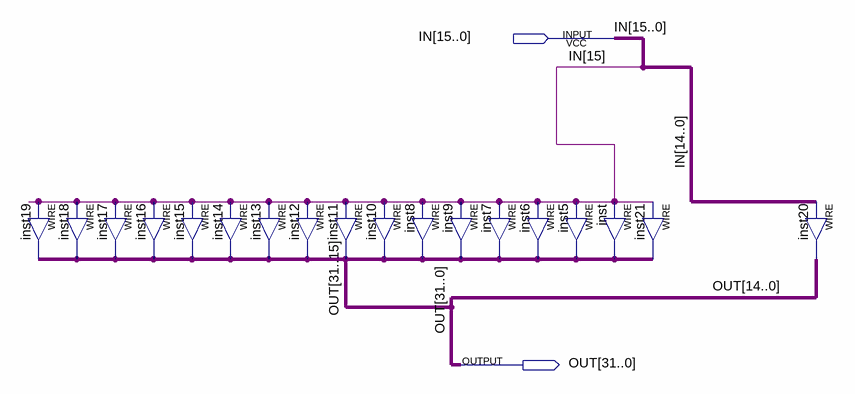
[diagram p0: schematic sheet]
// Quartus schematic sign_extend.bdf as structural Verilog: 18 symbols, 2 pins
module sign_extend (
  input  [15:0] IN,
  output [31:0] OUT
);

  assign OUT[31:15] = {17{IN[15]}};  // WIRE inst18
  assign OUT[31:15] = {17{IN[15]}};  // WIRE inst19
  assign OUT[31:15] = {17{IN[15]}};  // WIRE inst16
  assign OUT[31:15] = {17{IN[15]}};  // WIRE inst17
  assign OUT[31:15] = {17{IN[15]}};  // WIRE inst14
  assign OUT[31:15] = {17{IN[15]}};  // WIRE inst15
  assign OUT[31:15] = {17{IN[15]}};  // WIRE inst12
  assign OUT[31:15] = {17{IN[15]}};  // WIRE inst13
  assign OUT[31:15] = {17{IN[15]}};  // WIRE inst10
  assign OUT[31:15] = {17{IN[15]}};  // WIRE inst11
  assign OUT[31:15] = {17{IN[15]}};  // WIRE inst9
  assign OUT[31:15] = {17{IN[15]}};  // WIRE inst8
  assign OUT[31:15] = {17{IN[15]}};  // WIRE inst6
  assign OUT[31:15] = {17{IN[15]}};  // WIRE inst7
  assign OUT[31:15] = {17{IN[15]}};  // WIRE inst
  assign OUT[31:15] = {17{IN[15]}};  // WIRE inst5
  assign OUT[31:15] = {17{IN[15]}};  // WIRE inst21
  assign OUT[14:0] = IN[14:0];  // WIRE inst20
endmodule
